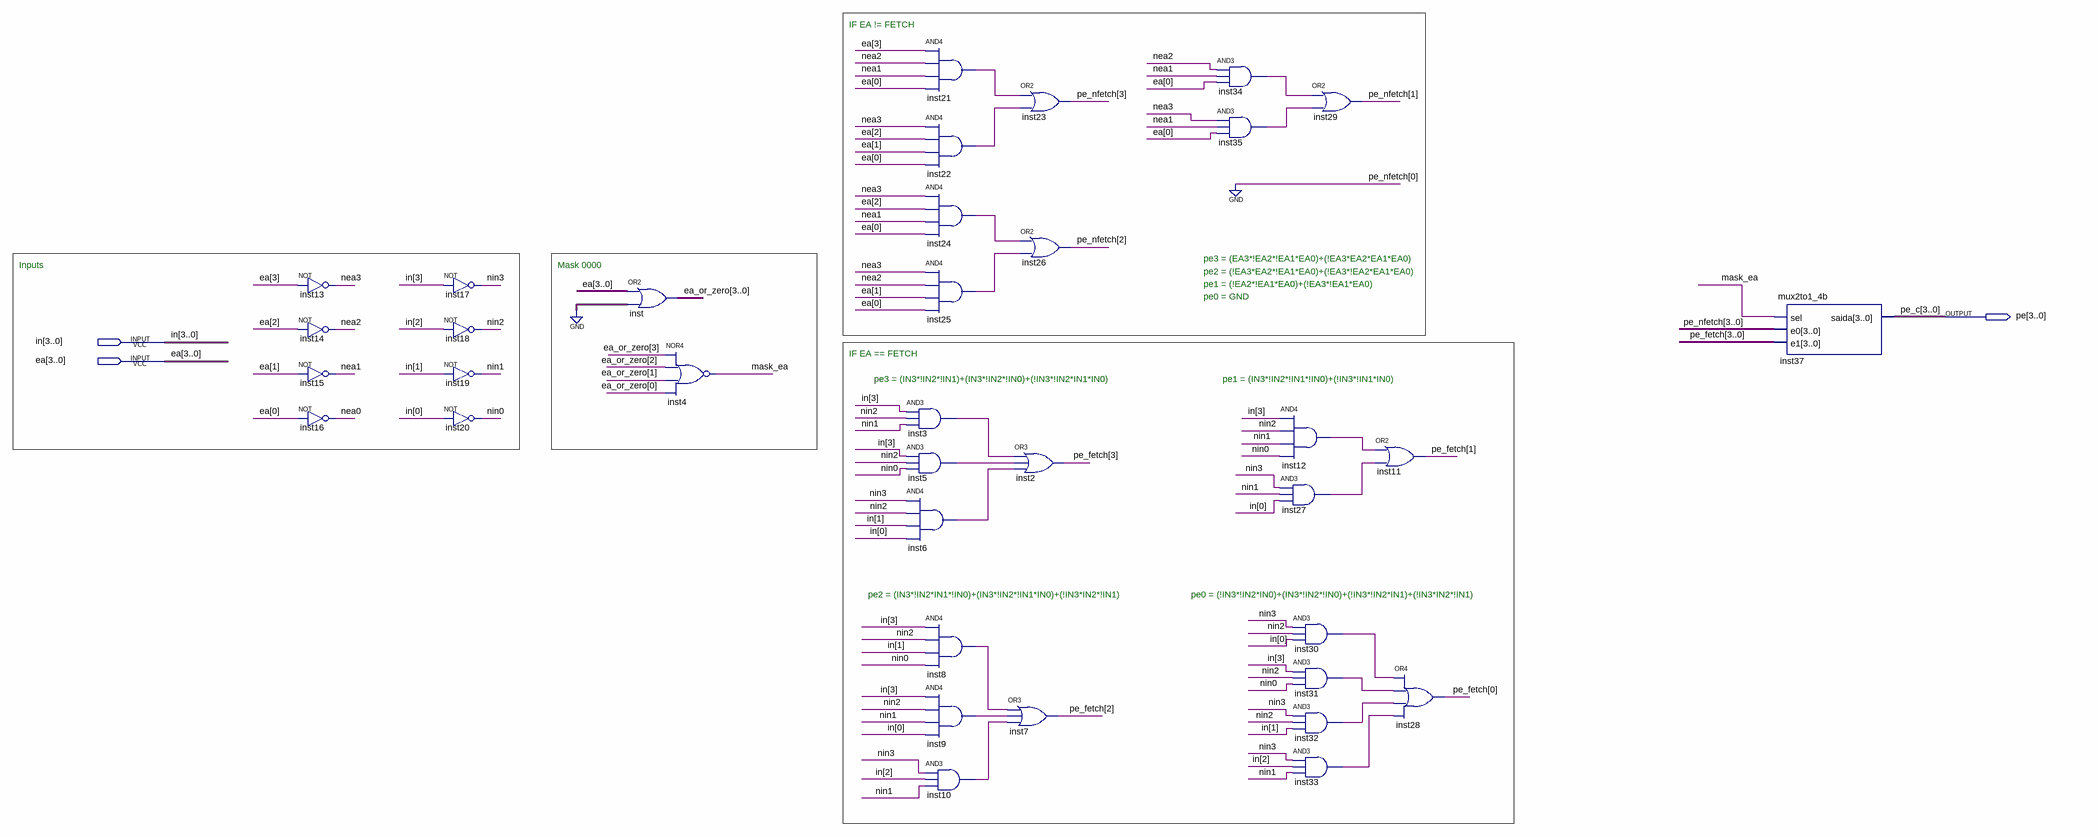
[diagram p0: schematic sheet]
// Quartus schematic ccpe.bdf as structural Verilog: 36 symbols, 3 pins
module ccpe (
  input  [3:0] in,
  input  [3:0] ea,
  output [3:0] pe
);

  wire inst3_out, inst5_out, inst6_out, inst8_out, inst9_out, inst10_out, inst12_out, inst21_out, inst22_out,
       inst24_out, inst25_out, inst27_out, inst30_out, inst31_out, inst32_out, inst33_out, inst34_out,
       inst35_out, mask_ea, nea0, nea1, nea2, nea3, nin0, nin1, nin2, nin3;
  wire [3:0] ea_or_zero, pe_fetch;
  wire [3:1] pe_nfetch;

  not inst13 (nea3, ea[3]);
  not inst14 (nea2, ea[2]);
  not inst15 (nea1, ea[1]);
  not inst16 (nea0, ea[0]);
  not inst17 (nin3, in[3]);
  not inst18 (nin2, in[2]);
  not inst19 (nin1, in[1]);
  not inst20 (nin0, in[0]);
  assign ea_or_zero = ea | 4'b0000;  // OR2 inst, 4 bits wide
  nor inst4 (mask_ea, ea_or_zero[3], ea_or_zero[2], ea_or_zero[1], ea_or_zero[0]);
  and inst21 (inst21_out, ea[3], nea2, nea1, ea[0]);
  and inst22 (inst22_out, nea3, ea[2], ea[1], ea[0]);
  and inst24 (inst24_out, nea3, ea[2], nea1, ea[0]);
  and inst25 (inst25_out, nea3, nea2, ea[1], ea[0]);
  and inst3 (inst3_out, in[3], nin2, nin1);
  and inst5 (inst5_out, in[3], nin2, nin0);
  and inst6 (inst6_out, nin3, nin2, in[1], in[0]);
  and inst8 (inst8_out, in[3], nin2, in[1], nin0);
  and inst9 (inst9_out, in[3], nin2, nin1, in[0]);
  and inst10 (inst10_out, nin3, in[2], nin1);
  or inst23 (pe_nfetch[3], inst21_out, inst22_out);
  or inst26 (pe_nfetch[2], inst24_out, inst25_out);
  or inst2 (pe_fetch[3], inst3_out, inst5_out, inst6_out);
  or inst7 (pe_fetch[2], inst8_out, inst9_out, inst10_out);
  and inst34 (inst34_out, nea2, nea1, ea[0]);
  and inst35 (inst35_out, nea3, nea1, ea[0]);
  and inst12 (inst12_out, in[3], nin2, nin1, nin0);
  and inst27 (inst27_out, nin3, nin1, in[0]);
  and inst30 (inst30_out, nin3, nin2, in[0]);
  and inst31 (inst31_out, in[3], nin2, nin0);
  and inst32 (inst32_out, nin3, nin2, in[1]);
  and inst33 (inst33_out, nin3, in[2], nin1);
  or inst29 (pe_nfetch[1], inst34_out, inst35_out);
  or inst11 (pe_fetch[1], inst12_out, inst27_out);
  or inst28 (pe_fetch[0], inst30_out, inst31_out, inst32_out, inst33_out);
  mux2to1_4b inst37 (.sel(mask_ea), .e0({pe_nfetch, 1'b0}), .e1(pe_fetch), .saida(pe));

  // Other names for the same wires on the sheet: pe_c[3:0] = pe

  // Notes on the sheet:
  //   IF EA != FETCH
  //   pe3 = (EA3*!EA2*!EA1*EA0)+(!EA3*EA2*EA1*EA0)
  //   Inputs
  //   Mask 0000
  //   pe2 = (!EA3*EA2*!EA1*EA0)+(!EA3*!EA2*EA1*EA0)
  //   pe1 = (!EA2*!EA1*EA0)+(!EA3*!EA1*EA0)
  //   pe0 = GND
  //   IF EA == FETCH
  //   pe3 = (IN3*!IN2*!IN1)+(IN3*!IN2*!IN0)+(!IN3*!IN2*IN1*IN0)
  //   pe1 = (IN3*!IN2*!IN1*!IN0)+(!IN3*!IN1*IN0)
  //   pe2 = (IN3*!IN2*IN1*!IN0)+(IN3*!IN2*!IN1*IN0)+(!IN3*IN2*!IN1)
  //   pe0 = (!IN3*!IN2*IN0)+(IN3*!IN2*!IN0)+(!IN3*!IN2*IN1)+(!IN3*IN2*!IN1)
endmodule
